# Altium schematic sheet Team_indication.SchDoc
size A
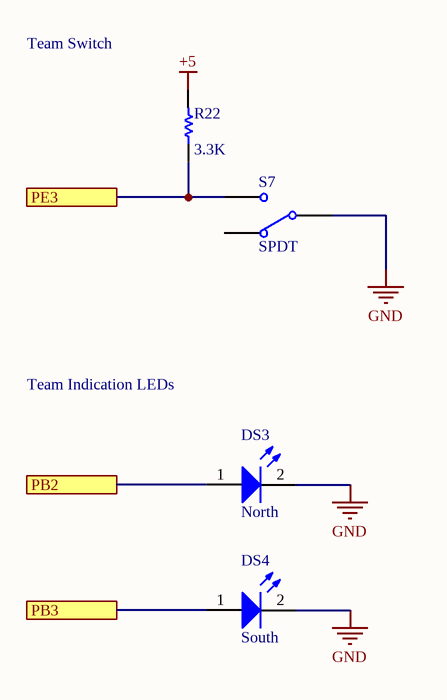
[diagram p0: Team_indication.SchDoc]

## Parts
DS3  North  [LED-1]
DS4  South  [LED-1]
R22  value 3.3K  [AXIAL-0.3]  (hidden comment: Res1)
S7  SPDT  [SPDT-3]

## Ports
PB2, PB3, PE3

## Nets
+5: R22.2
GND: DS3.2(K) DS4.2(K) S7.1(COMMON)
PB2: DS3.1(A) ; port PB2
PB3: DS4.1(A) ; port PB3
PE3: R22.1 S7.3(NO) ; port PE3

Not connected (* = marked no-connect by the designer): S7 2(NC)

## Notes on the sheet
- Team Switch
- Team Indication LEDs

## Library data of the parts
DS3 DS4 = LED1: Typical RED GaAs LED; Manufacturer: Generic Components; Class: Optoelectronic; Published: 08/06/2000; Publisher: Altium Hobart Technology Centre; SubClass: LED
R22 = Res1: Resistor; Manufacturer: Generic Components; Class: Passive; Published: 08/06/2000; Publisher: Altium Hobart Technology Centre; SubClass: Resistor
S7 = SW-SPDT: Single-Pole, Double-Throw Switch; Manufacturer: Generic Components; Published: 1999